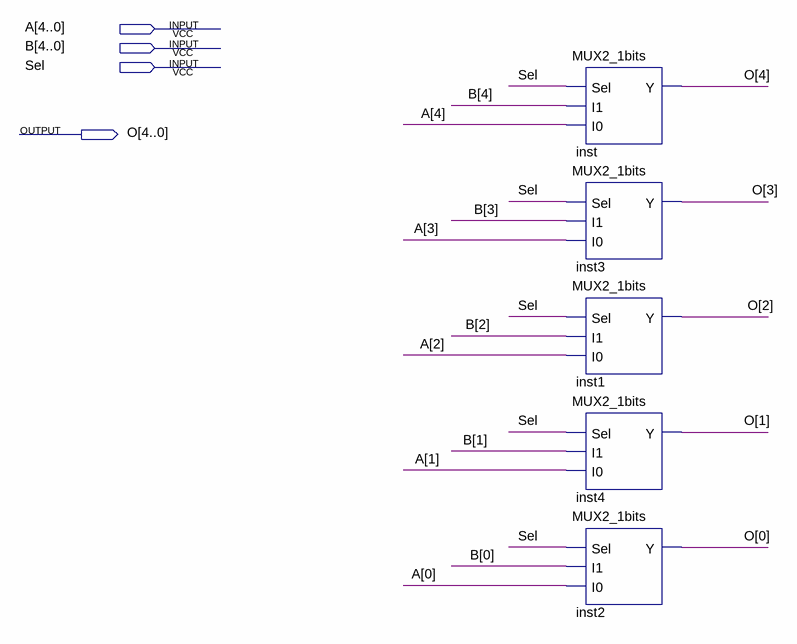
[diagram p0: schematic sheet]
// Quartus schematic Mux5to1.bdf as structural Verilog: 5 symbols, 4 pins
module Mux5to1 (
  input  [4:0] A,
  input  [4:0] B,
  input  Sel,
  output [4:0] O
);

  MUX2_1bits inst (.Sel(Sel), .I1(B[4]), .I0(A[4]), .Y(O[4]));
  MUX2_1bits inst3 (.Sel(Sel), .I1(B[3]), .I0(A[3]), .Y(O[3]));
  MUX2_1bits inst1 (.Sel(Sel), .I1(B[2]), .I0(A[2]), .Y(O[2]));
  MUX2_1bits inst4 (.Sel(Sel), .I1(B[1]), .I0(A[1]), .Y(O[1]));
  MUX2_1bits inst2 (.Sel(Sel), .I1(B[0]), .I0(A[0]), .Y(O[0]));
endmodule
